# EAGLE design invamp (EAGLE 8.4.0)
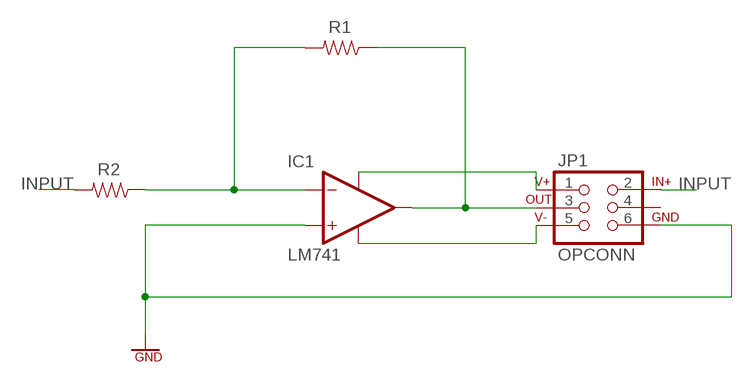
[diagram p0: schematic, sheet 1]

## Parts
IC1  LM741  [SO08]
JP1  OPCONN  [2X3]
R1  RES_0603  [SMD0603]
R2  RES_0603  [SMD0603]

## Nets
GND: IC1.3(IN+) JP1.6
INPUT: JP1.2 R2.2
N$1: IC1.6(OUT) JP1.3 R1.1
N$2: IC1.2(IN-) R1.2 R2.1
N$5: IC1.7(V+) JP1.1
N$6: IC1.4(V-) JP1.5
Unconnected: JP1.4

## Library data of the parts
IC1 = eagle-book:LM741: LM741 Operational Amplifier
JP1 = eagle-book:OPCONN: 6-pin connector for the op-amp circuit
R1 R2 = eagle-book:RES: Resistor

## Board
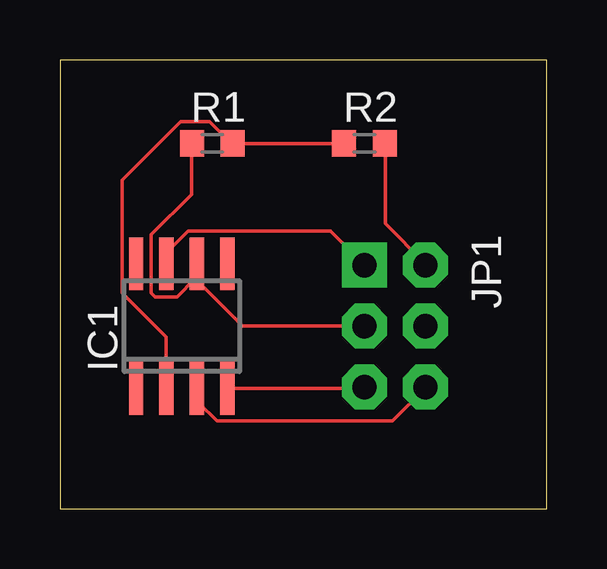
[diagram p1: board, top side]

Size 20.3 x 18.72 mm. Coordinates in mm from the lower left corner, seen from the top.
Outline: 0,0 20.3,0 20.3,18.72 0,18.72 0,0
Copper layers (1*16): Top 0.035mm / dielectric 1.5mm / Bottom 0.035mm
Design rules "default": minimum track width 6mil, minimum drill 0.35mm, track to track 6mil, track to pad 6mil, pad to pad 6mil, via to via 6mil, smd to smd 6mil, copper to edge 40mil, drill to drill 6mil, minimum pad ring 10mil, minimum via ring 8mil, stop-mask expansion 4mil, vias tented up to drill 0mil, thermal gap 10mil

### Footprints (pad centres in the part's own frame; a part is rotated, then mirrored left to right if it is on the bottom)
SO08 = smd 0.6 x 2.2: 1 -1.905,-2.6; 2 -0.635,-2.6; 3 0.635,-2.6; 4 1.905,-2.6; 5 1.905,2.6; 6 0.635,2.6; 7 -0.635,2.6; 8 -1.905,2.6
2X3 = drill 1.016 pad 1.88 square: 1 -2.54,-1.27 | drill 1.016 pad 1.88 octagon: 2 -2.54,1.27; 3 0,-1.27; 4 0,1.27; 5 2.54,-1.27; 6 2.54,1.27
SMD0603 = smd 1 x 1.1: 1 -0.85,0; 2 0.85,0

### Placement (x,y rotation side)
IC1  5.08,7.62 0 top
JP1  13.97,7.62 270 top
R1  6.35,15.24 0 top
R2  12.7,15.24 0 top

### Tracks (layer width: path | path; a pad name or v marks a point on that pad's centre or on a via)
GND
  Top 0.152: IC1.3 5.79,4.88 5.79,4.42 6.55,3.66 13.87,3.66 15.24,5.03 JP1.6
INPUT
  Top 0.152: R2.2 13.56,15.24 13.56,11.89 15.24,10.21 JP1.2
N$1
  Top 0.152: 5.64,9.6 4.88,8.84 3.96,8.84 3.81,8.99 3.81,11.43 5.49,13.11 5.49,15.24 R1.1 | 5.64,9.6 5.64,10.21 IC1.6 5.64,9.6 | 5.64,9.6 7.62,7.62 JP1.3
N$2
  Top 0.152: R2.1 R1.2 7.16,15.24 6.25,16.15 5.03,16.15 2.59,13.72 2.59,8.99 4.42,7.16 4.42,5.03 IC1.2
N$5
  Top 0.152: JP1.1 11.28,11.58 5.33,11.58 4.57,10.82 4.57,10.36 IC1.7
N$6
  Top 0.152: IC1.4 7.01,5.03 12.65,5.03 JP1.5